# EAGLE design satshakit-nero (EAGLE 8.1.0)
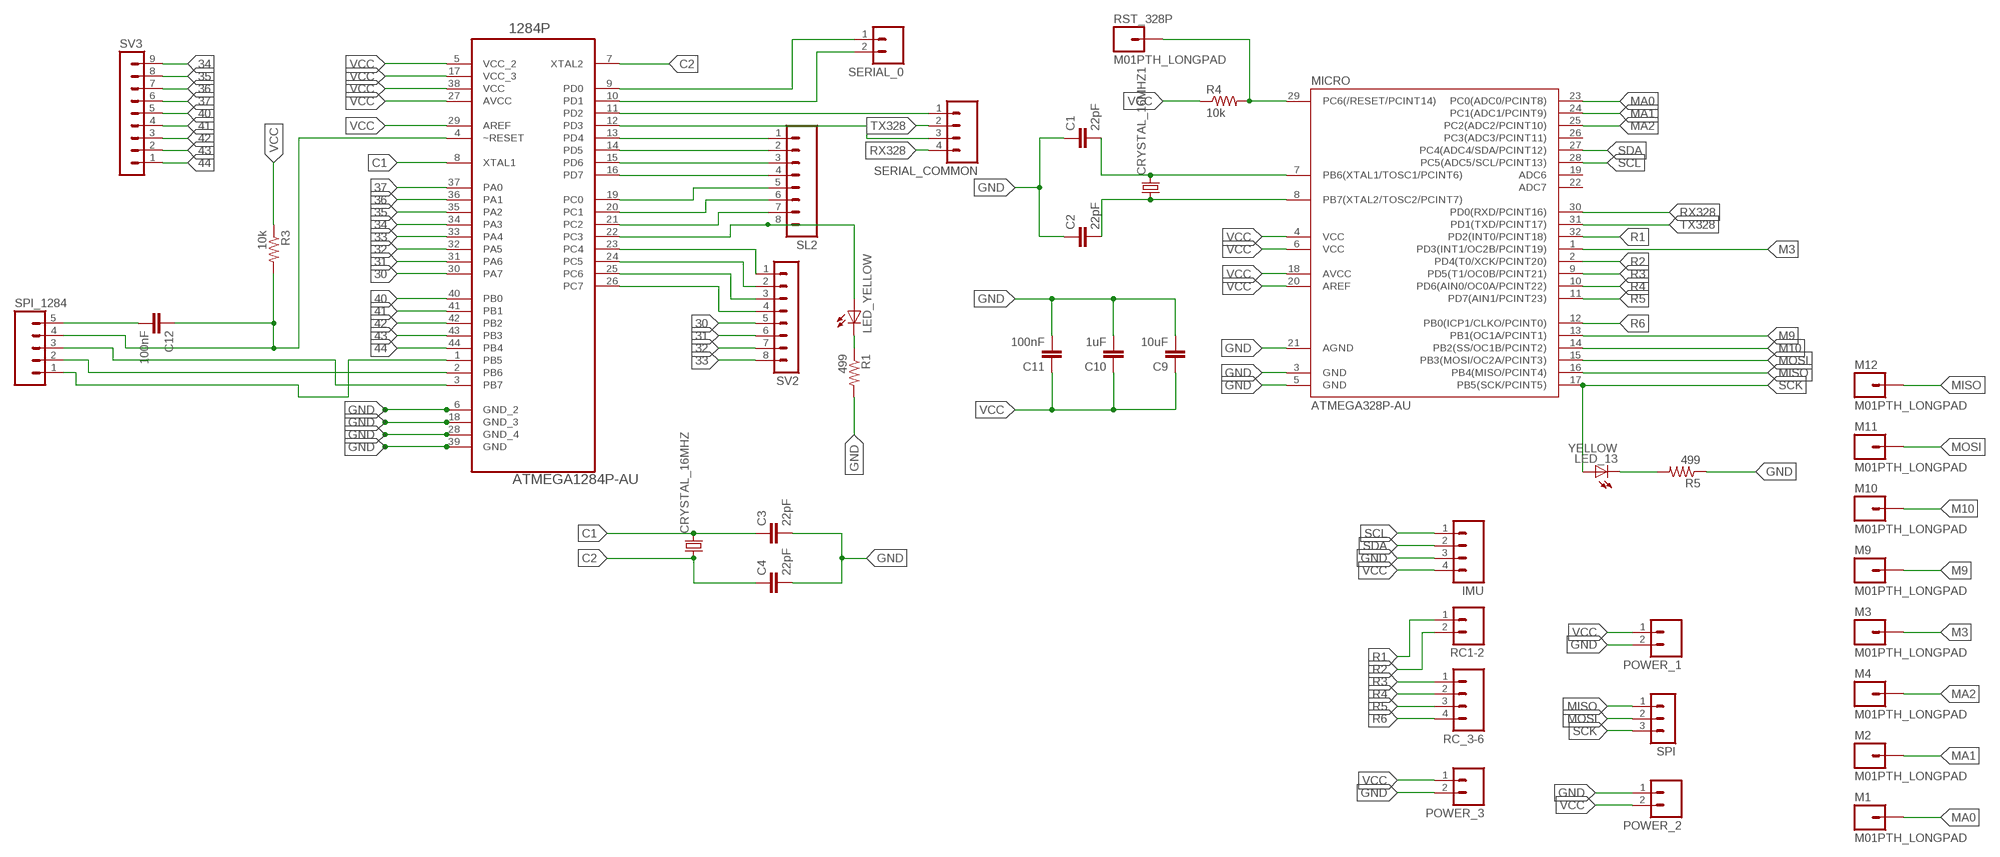
[diagram p0: schematic, sheet 1]

## Parts
1284P  ATMEGA1284P-AU  [QFP80P1200X1200X120-44N]
C1  22pF  CAP1206  [1206]
C2  22pF  CAP1206  [1206]
C3  22pF  CAP1206  [1206]
C4  22pF  CAP1206  [1206]
C9  10uF  CAP1206  [1206]
C10  1uF  CAP1206  [1206]
C11  100nF  CAP1206  [1206]
C12  100nF  CAP1206  [1206]
CRYSTAL_16MHZ  CRYSTALHC49UP  [HC49UP]
CRYSTAL_16MHZ1  CRYSTALHC49UP  [HC49UP]
IMU  M04  [04P]
LED_13  YELLOW  LED1206  [1206]
LED_YELLOW  LED1206  [1206]
M1  M01PTH_LONGPAD  [1X01_LONGPAD]
M2  M01PTH_LONGPAD  [1X01_LONGPAD]
M3  M01PTH_LONGPAD  [1X01_LONGPAD]
M4  M01PTH_LONGPAD  [1X01_LONGPAD]
M9  M01PTH_LONGPAD  [1X01_LONGPAD]
M10  M01PTH_LONGPAD  [1X01_LONGPAD]
M11  M01PTH_LONGPAD  [1X01_LONGPAD]
M12  M01PTH_LONGPAD  [1X01_LONGPAD]
MICRO  ATMEGA328P-AU  ATMEGA48/88/168-AU  [TQFP32-08]
POWER_1  M02  [02P]
POWER_2  M02  [02P]
POWER_3  M02  [02P]
R1  499  RES-US1206  [R1206]
R3  10k  RES-US1206  [R1206]
R4  10k  RESISTOR1206  [1206]
R5  499  RESISTOR1206  [1206]
RC1-2  M02  [02P]
RC_3-6  M04LONGPADS  [1X04_LONGPADS]
RST_328P  M01PTH_LONGPAD  [1X01_LONGPAD]
SERIAL_0  M02  [02P]
SERIAL_COMMON  M04  [04P]
SL2  M08  [08P]
SPI  MA03-1  [MA03-1]
SPI_1284  M05  [05P]
SV2  MA08-1  [MA08-1]
SV3  MA09-1  [MA09-1]

## Nets
30: 1284P.30(PA7) SV2.5
31: 1284P.31(PA6) SV2.6
32: 1284P.32(PA5) SV2.7
33: 1284P.33(PA4) SV2.8
34: 1284P.34(PA3) SV3.9
35: 1284P.35(PA2) SV3.8
36: 1284P.36(PA1) SV3.7
37: 1284P.37(PA0) SV3.6
40: 1284P.40(PB0) SV3.5
41: 1284P.41(PB1) SV3.4
42: 1284P.42(PB2) SV3.3
43: 1284P.43(PB3) SV3.2
44: 1284P.44(PB4) SV3.1
C1: 1284P.8(XTAL1) C3.1 CRYSTAL_16MHZ.2
C2: 1284P.7(XTAL2) C4.1 CRYSTAL_16MHZ.1
GND: 1284P.6(GND_2) C1.1 C2.1 C3.2 C4.2 C9.2 C10.2 C11.2 IMU.3 MICRO.3(GND) MICRO.5(GND) MICRO.21(AGND) POWER_1.2 POWER_2.1 POWER_3.2 R1.2 R5.1
M3: M3.1 MICRO.1(PD3(INT1/OC2B/PCINT19))
M9: M9.1 MICRO.13(PB1(OC1A/PCINT1))
M10: M10.1 MICRO.14(PB2(SS/OC1B/PCINT2))
MA0: M1.1 MICRO.23(PC0(ADC0/PCINT8))
MA1: M2.1 MICRO.24(PC1(ADC1/PCINT9))
MA2: M4.1 MICRO.25(PC2(ADC2/PCINT10))
MISO: M12.1 MICRO.16(PB4(MISO/PCINT4)) SPI.1
MOSI: M11.1 MICRO.15(PB3(MOSI/OC2A/PCINT3)) SPI.2
N$1: 1284P.18(GND_3)
N$2: 1284P.28(GND_4)
N$3: 1284P.39(GND)
N$4: 1284P.19(PC0) SL2.5
N$5: 1284P.20(PC1) SL2.6
N$6: 1284P.38(VCC)
N$7: 1284P.16(PD7) SL2.4
N$8: 1284P.14(PD5) SL2.2
N$9: 1284P.13(PD4) SL2.1
N$10: 1284P.12(PD3) SERIAL_COMMON.3
N$11: 1284P.11(PD2) SERIAL_COMMON.1
N$12: 1284P.9(PD0) SERIAL_0.1
N$13: 1284P.10(PD1) SERIAL_0.2
N$14: 1284P.21(PC2) SL2.7
N$15: 1284P.22(PC3) LED_YELLOW.1(A) SL2.8
N$16: 1284P.23(PC4) SV2.1
N$17: 1284P.24(PC5) SV2.2
N$18: 1284P.25(PC6) SV2.3
N$19: 1284P.26(PC7) SV2.4
N$20: 1284P.15(PD6) SL2.3
N$21: 1284P.3(PB7) SPI_1284.3
N$22: 1284P.2(PB6) SPI_1284.2
N$23: 1284P.1(PB5) SPI_1284.1
N$24: 1284P.4(~RESET) C12.1 R3.2 SPI_1284.4
N$25: LED_YELLOW.2(C) R1.1
N$27: C12.2 SPI_1284.5
N$28: C1.2 CRYSTAL_16MHZ1.2 MICRO.7(PB6(XTAL1/TOSC1/PCINT6))
N$29: C2.2 CRYSTAL_16MHZ1.1 MICRO.8(PB7(XTAL2/TOSC2/PCINT7))
N$30: MICRO.29(PC6(/RESET/PCINT14)) R4.2 RST_328P.1
N$31: LED_13.2(C) R5.2
R1: MICRO.32(PD2(INT0/PCINT18)) RC1-2.1
R2: MICRO.2(PD4(T0/XCK/PCINT20)) RC1-2.2
R3: MICRO.9(PD5(T1/OC0B/PCINT21)) RC_3-6.1
R4: MICRO.10(PD6(AIN0/OC0A/PCINT22)) RC_3-6.2
R5: MICRO.11(PD7(AIN1/PCINT23)) RC_3-6.3
R6: MICRO.12(PB0(ICP1/CLKO/PCINT0)) RC_3-6.4
RX328: MICRO.30(PD0(RXD/PCINT16)) SERIAL_COMMON.4
SCK: LED_13.1(A) MICRO.17(PB5(SCK/PCINT5)) SPI.3
SCL: IMU.1 MICRO.28(PC5(ADC5/SCL/PCINT13))
SDA: IMU.2 MICRO.27(PC4(ADC4/SDA/PCINT12))
TX328: MICRO.31(PD1(TXD/PCINT17)) SERIAL_COMMON.2
VCC: 1284P.5(VCC_2) 1284P.17(VCC_3) 1284P.27(AVCC) 1284P.29(AREF) C9.1 C10.1 C11.1 IMU.4 MICRO.4(VCC) MICRO.6(VCC) MICRO.18(AVCC) MICRO.20(AREF) POWER_1.1 POWER_2.2 POWER_3.1 R3.1 R4.1
Unconnected: MICRO.19(ADC6) MICRO.22(ADC7) MICRO.26(PC3(ADC3/PCINT11))

## Library data of the parts
1284P = 1284:ATMEGA1284P-AU: Microcontroller with Programmable Flash; MPN: ATMEGA1284P-AU; OC_FARNELL: 1715480; OC_NEWARK: 15R0263; PACKAGE: TQFP-44; SUPPLIER: Atmel
C1-C4 C9-C12 = 01_SparkFun:CAP: Capacitor Standard 0603 ceramic capacitor, and 0.1" leaded capacitor.
CRYSTAL_16MHZ CRYSTAL_16MHZ1 = crystal:CRYSTAL: CRYSTAL; OC_FARNELL: unknown; OC_NEWARK: unknown
IMU SERIAL_COMMON = con-amp-quick:M04: AMP QUICK CONNECTOR; OC_FARNELL: unknown; OC_NEWARK: unknown
LED_13 = 01_FAB_Hello:LED
LED_YELLOW = FAB_Hello:LED
M1-M4 M9-M12 RST_328P = 01_SparkFun:M01: Header 1 Standard 1-pin 0.1" header. Use with straight break away headers (SKU : PRT-00116), right angle break away headers (PRT-00553), swiss pins (PRT-00743), machine pins (PRT-00117), and female headers (PRT-00115).
MICRO = atmega8:ATMEGA48/88/168
POWER_1-POWER_3 RC1-2 SERIAL_0 = con-amp-quick:M02: AMP QUICK CONNECTOR; OC_FARNELL: unknown; OC_NEWARK: unknown
R1 R3 = fab:RES-US: Resistor (US Symbol) Variants with postfix FAB are widened to allow the routing of internal traces
R4 R5 = 01_SparkFun:RESISTOR: Resistor Basic schematic elements and footprints for 0603, 1206, and PTH 1/10th watt (small) resistors.
RC_3-6 = 01_SparkFun:M04: Header 4 Standard 4-pin 0.1" header. Use with straight break away headers (SKU : PRT-00116), right angle break away headers (PRT-00553), swiss pins (PRT-00743), machine pins (PRT-00117), and female headers (PRT-00115). Molex polarized connector foot print use with SKU : PRT-08231 with associated crimp pins and housings.
SL2 = con-amp-quick:M08: AMP QUICK CONNECTOR; OC_FARNELL: unknown; OC_NEWARK: unknown
SPI = con-lstb:MA03-1: PIN HEADER; OC_FARNELL: unknown; OC_NEWARK: unknown
SPI_1284 = con-amp-quick:M05: AMP QUICK CONNECTOR; OC_FARNELL: unknown; OC_NEWARK: unknown
SV2 = con-lstb:MA08-1: PIN HEADER; OC_FARNELL: unknown; OC_NEWARK: unknown
SV3 = con-lstb:MA09-1: PIN HEADER; OC_FARNELL: unknown; OC_NEWARK: unknown

## Board
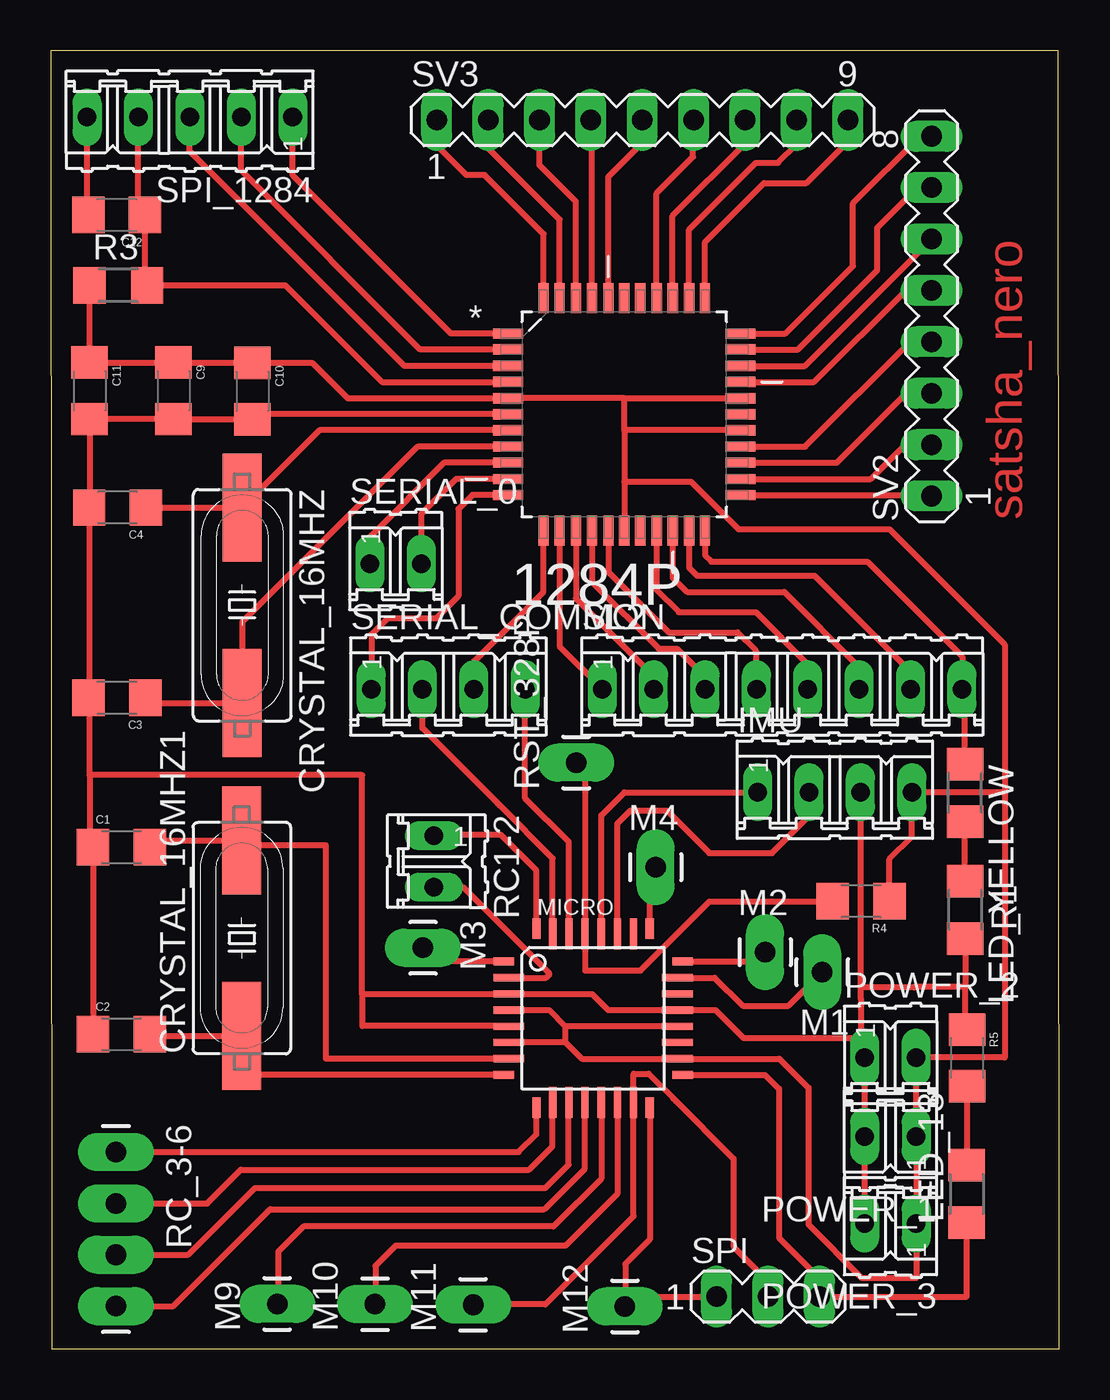
[diagram p1: board, top side]

Size 49.85 x 64.15 mm. Coordinates in mm from the lower left corner, seen from the top.
Outline: 0.05,0 49.85,0 49.8,64.15 0,64.15 0.05,0
Copper layers (1*16): Top 0.035mm / dielectric 1.5mm / Bottom 0.035mm
Design rules "default": minimum track width 10mil, minimum drill 24mil, track to track 8mil, track to pad 8mil, pad to pad 8mil, via to via 8mil, smd to smd 8mil, copper to edge 40mil, drill to drill 8mil, minimum pad ring 10mil, minimum via ring 8mil, stop-mask expansion 4mil, vias tented up to drill 0mil, thermal gap 10mil

### Footprints (pad centres in the part's own frame; a part is rotated, then mirrored left to right if it is on the bottom)
QFP80P1200X1200X120-44N = smd 1.473 x 0.508: 1 -5.74,3.988; 2 -5.74,3.2; 3 -5.74,2.388; 4 -5.74,1.6; 5 -5.74,0.787; 6 -5.74,0; 7 -5.74,-0.787; 8 -5.74,-1.6; 9 -5.74,-2.388; 10 -5.74,-3.2; 11 -5.74,-3.988; 23 5.74,-3.988; 24 5.74,-3.2; 25 5.74,-2.388; 26 5.74,-1.6; 27 5.74,-0.787; 28 5.74,0; 29 5.74,0.787; 30 5.74,1.6; 31 5.74,2.388; 32 5.74,3.2; 33 5.74,3.988 | smd 0.508 x 1.473: 12 -3.988,-5.74; 13 -3.2,-5.74; 14 -2.388,-5.74; 15 -1.6,-5.74; 16 -0.787,-5.74; 17 0,-5.74; 18 0.787,-5.74; 19 1.6,-5.74; 20 2.388,-5.74; 21 3.2,-5.74; 22 3.988,-5.74; 34 3.988,5.74; 35 3.2,5.74; 36 2.388,5.74; 37 1.6,5.74; 38 0.787,5.74; 39 0,5.74; 40 -0.787,5.74; 41 -1.6,5.74; 42 -2.388,5.74; 43 -3.2,5.74; 44 -3.988,5.74
1206 = smd 1.6 x 1.8: 1 -1.4,0; 2 1.4,0
HC49UP = smd 5.334 x 1.93: 1 -4.826,0; 2 4.826,0
04P = drill 0.914 long: 1 -3.81,0; 2 -1.27,0; 3 1.27,0; 4 3.81,0
1206' = smd 1.6 x 1.803: 1 -1.422,0; 2 1.422,0
1X01_LONGPAD = drill 1.016 pad 1.88 long: 1 0,0
TQFP32-08 = smd 1.016 x 0.406: 1 -4.42,2.8; 8 -4.42,-2.8; 17 4.42,-2.8; 24 4.42,2.8 | smd 1.524 x 0.356: 2 -4.166,2; 3 -4.166,1.2; 4 -4.166,0.4; 5 -4.166,-0.4; 6 -4.166,-1.2; 7 -4.166,-2; 18 4.166,-2; 19 4.166,-1.2; 20 4.166,-0.4; 21 4.166,0.4; 22 4.166,1.2; 23 4.166,2 | smd 0.406 x 1.016: 9 -2.8,-4.42; 16 2.8,-4.42; 25 2.8,4.42; 32 -2.8,4.42 | smd 0.356 x 1.524: 10 -2,-4.166; 11 -1.2,-4.166; 12 -0.4,-4.166; 13 0.4,-4.166; 14 1.2,-4.166; 15 2,-4.166; 26 2,4.166; 27 1.2,4.166; 28 0.4,4.166; 29 -0.4,4.166; 30 -1.2,4.166; 31 -2,4.166
02P = drill 0.914 long: 1 -1.27,0; 2 1.27,0
R1206 = smd 1.6 x 1.803: 1 -1.422,0; 2 1.422,0
1X04_LONGPADS = drill 1.016 pad 1.88 long: 1 0,0; 2 2.54,0; 3 5.08,0; 4 7.62,0
08P = drill 0.914 long: 1 -8.89,0; 2 -6.35,0; 3 -3.81,0; 4 -1.27,0; 5 1.27,0; 6 3.81,0; 7 6.35,0; 8 8.89,0
MA03-1 = drill 1.016 long: 1 -2.54,0; 2 0,0; 3 2.54,0
05P = drill 0.914 long: 1 -5.08,0; 2 -2.54,0; 3 0,0; 4 2.54,0; 5 5.08,0
MA08-1 = drill 1.016 long: 1 -8.89,0; 2 -6.35,0; 3 -3.81,0; 4 -1.27,0; 5 1.27,0; 6 3.81,0; 7 6.35,0; 8 8.89,0
MA09-1 = drill 1.016 long: 1 -10.16,0; 2 -7.62,0; 3 -5.08,0; 4 -2.54,0; 5 0,0; 6 2.54,0; 7 5.08,0; 8 7.62,0; 9 10.16,0

### Placement (x,y rotation side)
1284P  28.35,46.18 0 top
C1  3.5,24.8 0 top
C2  3.5,15.55 0 top
C3  3.28,32.17 180 top
C4  3.31,41.57 180 top
C9  6.08,47.34 270 top
C10  9.98,47.32 270 top
C11  1.93,47.34 270 top
C12  3.27,56.02 180 top
CRYSTAL_16MHZ  9.47,36.75 270 top
CRYSTAL_16MHZ1  9.45,20.3 90 top
IMU  38.75,27.5 0 top
LED_13  YELLOW  [1206']  45.27,7.66 90 top
LED_YELLOW  [1206']  45.18,27.47 270 top
M1  38.13,18.62 180 top
M2  35.31,19.6 0 top
M3  18.4,19.82 270 top
M4  29.9,23.8 0 top
M9  11.2,2.22 90 top
M10  16.03,2.21 90 top
M11  20.88,2.18 90 top
M12  28.38,2.1 90 top
MICRO  26.81,16.34 0 top
POWER_1  41.5,10.5 180 top
POWER_2  41.5,14.4 0 top
POWER_3  41.5,6.2 180 top
R1  45.2,21.69 270 top
R3  3.35,52.55 0 top
R4  40.05,22.12 180 top
R5  45.28,14.38 270 top
RC1-2  18.94,24.09 270 top
RC_3-6  3.23,9.73 270 top
RST_328P  25.98,28.97 90 top
SERIAL_0  17.05,38.8 0 top
SERIAL_COMMON  19.65,32.6 0 top
SL2  36.15,32.6 0 top
SPI  35.45,2.58 0 top
SPI_1284  6.88,60.86 180 top
SV2  43.54,51.03 90 top
SV3  29.24,60.72 0 top

### Tracks (layer width: path | path; a pad name or v marks a point on that pad's centre or on a via)
30
  Top 0.305: 1284P.30 37.73,47.78 42.25,52.3 SV2.5
31
  Top 0.305: 1284P.31 37.27,48.57 SV2.6
32
  Top 0.305: 1284P.32 36.93,49.38 40.85,53.3 40.85,55.4 42.83,57.38 SV2.7
33
  Top 0.305: 1284P.33 36.32,50.17 39.65,53.5 39.65,56.6 42.97,59.92 SV2.8
34
  Top 0.305: 1284P.34 32.34,54.69 35.25,57.6 37.35,57.6 39.45,59.7 39.45,60.67 SV3.9
35
  Top 0.305: 1284P.35 31.55,55.3 34.85,58.6 35.95,58.6 36.85,59.5 SV3.8
36
  Top 0.305: 1284P.36 30.74,55.99 34.35,59.6 34.35,60.69 SV3.7
37
  Top 0.305: 1284P.37 29.95,57.1 31.75,58.9 31.75,60.69 SV3.6
40
  Top 0.305: 1284P.40 27.56,57.91 29.25,59.6 SV3.5
41
  Top 0.305: 1284P.41 26.75,60.67 SV3.4
42
  Top 0.305: 1284P.42 25.96,56.69 24.15,58.5 SV3.3
43
  Top 0.305: 1284P.43 25.15,55.8 21.65,59.3 21.65,60.69 SV3.2
44
  Top 0.305: 1284P.44 24.36,55.09 21.45,58 20.55,58 19.05,59.5 19.05,60.69 SV3.1
C1
  Top 0.305: CRYSTAL_16MHZ.2 9.85,31.94 | 1284P.8 18.13,44.58 9.47,35.92 CRYSTAL_16MHZ.2 | 9.45,31.94 CRYSTAL_16MHZ.2 | C3.1 4.68,31.92 CRYSTAL_16MHZ.2
C2
  Top 0.305: CRYSTAL_16MHZ.1 9.86,41.57 | C4.1 CRYSTAL_16MHZ.1 | 1284P.7 13.29,45.39 CRYSTAL_16MHZ.1
GND
  Top 0.305: 6.48,45.83 C9.2 | 1284P.6 10.24,46.18 C10.2 9.96,45.94 C9.2 | MICRO.5 15.4,15.95 15.4,17.5 | MICRO.21 | 15.4,17.5 15.4,28.35 1.93,28.35 | C9.2 C11.2 1.93,41.59 C4.2 1.91,32.17 C3.2 1.93,32.17 1.93,28.35 | 45.28,20.44 R1.2 45.2,17.88 | 40.02,17.88 42.65,17.88 | 15.4,17.5 15.44,17.54 MICRO.3 26.76,17.54 27.55,16.75 30.97,16.75 MICRO.21 | 1.93,28.35 1.93,24.8 C1.1 C2.1 | MICRO.21 32.86,16.74 34.25,15.35 40.05,15.35 | IMU.3 40.02,17.88 | 40.02,17.88 40.02,17.3 40.05,17.3 40.05,15.35 | 42.67,17.86 42.65,17.88 | 40.05,15.35 40.23,15.35 POWER_2.1 POWER_1.2 POWER_3.2 | 45.2,17.88 42.65,17.88 | R5.1 45.2,15.78 45.2,17.88
M3
  Top 0.305: MICRO.1 19.08,19.14 M3.1
M9
  Top 0.305: MICRO.13 27.21,8.41 24.85,6.05 12.5,6.05 11.25,4.8 11.25,2.27 M9.1
M10
  Top 0.305: MICRO.14 28.01,7.66 25.45,5.1 17.05,5.1 16.05,4.1 16.05,2.23 M10.1
MA0
  Top 0.305: MICRO.23 32.81,18.34 34.2,16.95 36.46,16.95 M1.1
MA1
  Top 0.305: MICRO.24 34.85,19.14 M2.1
MA2
  Top 0.305: MICRO.25 29.61,23.51 M4.1
MISO
  Top 0.305: MICRO.16 29.61,5.41 28.4,4.2 28.4,2.12 M12.1 28.38,2.58 SPI.1
MOSI
  Top 0.305: M11.1 20.9,2.2 24.45,2.2 28.81,6.56 MICRO.15 28.81,13.6 29.55,13.6 30.78,12.38 | 30.78,12.38 30.9,12.25 | SPI.2 35.45,3.35 33.75,5.05 33.75,9.4 30.78,12.38
N$4
  Top 0.305: 1284P.19 29.95,37.5 31.05,36.4 34.85,36.4 37.45,33.8 37.45,32.63 SL2.5
N$5
  Top 0.305: 1284P.20 30.74,38.11 31.45,37.4 36.25,37.4 39.95,33.7 SL2.6
N$7
  Top 0.305: 1284P.16 27.56,38.39 30.55,35.4 33.95,35.4 34.85,34.5 34.85,32.63 SL2.4
N$8
  Top 0.305: 1284P.14 25.96,37.09 29.85,33.2 29.85,32.65 SL2.2
N$9
  Top 0.305: 1284P.13 25.15,34.71 SL2.1
N$10
  Top 0.305: SERIAL_COMMON.3 20.92,33.97 24.35,37.4 24.35,40.43 1284P.12
N$11
  Top 0.305: 1284P.11 20.84,42.19 20.15,41.5 20.15,37.2 19.05,36.1 16.65,36.1 15.85,35.3 SERIAL_COMMON.1 | SERIAL_COMMON.1
N$12
  Top 0.305: 1284P.9 19.44,43.79 15.85,40.2 15.85,38.87 SERIAL_0.1
N$13
  Top 0.305: SERIAL_0.2 18.32,41.27 20.05,43 22.59,43 1284P.10
N$14
  Top 0.305: 1284P.21 31.55,38.6 31.95,38.2 37.75,38.2 42.45,33.5 42.45,32.65 SL2.7
N$15
  Top 0.305: 1284P.22 32.34,39.21 32.65,38.9 40.35,38.9 45.05,34.2 SL2.8 45.18,32.46 LED_YELLOW.1
N$16
  Top 0.305: 1284P.23 43.54,42.19 SV2.1
N$17
  Top 0.305: 43.54,44.7 SV2.2 43.52,44.7 42.25,44.7 40.53,42.98 1284P.24
N$18
  Top 0.305: SV2.3 42.87,47.22 42.85,47.2 42.25,47.2 38.84,43.79 1284P.25
N$19
  Top 0.305: SV2.4 43.01,49.76 43,49.75 42.45,49.75 37.28,44.58 1284P.26
N$20
  Top 0.305: 1284P.15 26.75,37.9 30.05,34.6 30.95,34.6 32.35,33.2 SL2.3
N$21
  Top 0.305: 1284P.3 17.48,48.57 6.88,59.17 SPI_1284.3 6.85,60.83
N$22
  Top 0.305: 1284P.2 18.27,49.38 9.42,58.23 SPI_1284.2
N$23
  Top 0.305: 1284P.1 19.78,50.17 11.96,57.99 SPI_1284.1
N$24
  Top 0.305: 1284P.4 16.37,47.78 11.6,52.55 R3.2 4.67,52.55 C12.1 4.34,56.02 SPI_1284.4
N$25
  Top 0.305: 45.2,26.03 LED_YELLOW.2 45.18,23.11 R1.1
N$27
  Top 0.305: C12.2 1.8,56.02 SPI_1284.5
N$28
  Top 0.305: MICRO.7 13.6,14.34 13.6,24.9 9.45,24.9 CRYSTAL_16MHZ1.2 | CRYSTAL_16MHZ1.2 9.23,24.91 | C1.2 5.23,25.13 CRYSTAL_16MHZ1.2
N$29
  Top 0.305: MICRO.8 9.45,13.54 CRYSTAL_16MHZ1.1 5.4,15.47 | 5.4,15.47 5.09,15.47 | C2.2 4.98,15.47 5.4,15.47
N$30
  Top 0.305: RST_328P.1 26.41,28.54 MICRO.29 26.41,18.7 29.15,18.7 32.55,22.1 38.63,22.1 R4.2
N$31
  Top 0.305: 45.27,12.43 LED_13.2 | 45.27,12.43 45.28,12.44 | R5.2 45.27,12.43
R1
  Top 0.305: MICRO.32 24.01,23.64 22.25,25.4 18.98,25.4 RC1-2.1
R2
  Top 0.305: MICRO.2 24.49,18.34 24.65,18.5 24.65,18.55 20.38,22.82 RC1-2.2
R3
  Top 0.305: RC_3-6.1 23.13,9.73 24,10.6 MICRO.9
R4
  Top 0.305: RC_3-6.2 7.74,7.19 9.4,8.85 23.65,8.85 24.8,10 MICRO.10
R5
  Top 0.305: RC_3-6.3 6.8,4.65 10.1,7.95 24.45,7.95 25.6,9.1 MICRO.11
R6
  Top 0.305: RC_3-6.4 6.06,2.11 10.85,6.9 24.4,6.9 26.4,8.9 MICRO.12
RX328
  Top 0.305: MICRO.30 25.61,25.04 23.45,27.2 SERIAL_COMMON.4
SCK
  Top 0.305: SPI.3 37.99,2.81 | LED_13.1 45.27,2.58 SPI.3 | SPI.3 38,3.5 36,5.5 36,12.85 35.31,13.54 MICRO.17
SCL
  Top 0.305: MICRO.28 27.21,26.36 28.35,27.5 IMU.1
SDA
  Top 0.305: MICRO.27 28.01,25.96 28.65,26.6 30.45,26.6 32.55,24.5 35.65,24.5 37.45,26.3 37.45,27.47 IMU.2
TX328
  Top 0.305: MICRO.31 24.81,24.24 22.2,26.85 | 22.2,26.85 22.1,26.95 | 18.4,32.58 SERIAL_COMMON.2 18.38,30.67 22.2,26.85
VCC
  Top 0.305: 6.43,48.79 C9.1 | 28.35,46.97 1284P.5 14.68,46.97 12.95,48.7 10,48.7 C10.1 9.96,48.74 C9.1 | 28.35,46.97 1284P.29 | 28.35,45.39 28.35,42.85 | 28.35,42.85 1284P.17 | 1284P.27 28.35,45.39 | 28.35,45.39 28.35,46.97 | 25.45,15.14 25.45,15.94 | 25.45,15.14 MICRO.6 | MICRO.20 25.45,15.94 | 28.35,42.85 31.65,42.85 34,40.5 41.45,40.5 47.15,34.8 47.15,27.5 | R3.1 C11.1 C9.1 | 41.67,21.9 R4.1 41.45,24.2 42.55,25.3 IMU.4 47.15,27.5 | MICRO.4 24.65,16.74 25.45,15.94 | 25.45,15.14 26.25,14.34 MICRO.18 36.01,14.34 37.45,12.9 37.45,6.15 40.1,3.5 42.77,3.5 POWER_3.1 POWER_1.1 POWER_2.2 | POWER_2.2 42.75,14.4 | POWER_2.2 47.15,14.4 47.15,27.5

### Text on the board
Top: satsha_nero